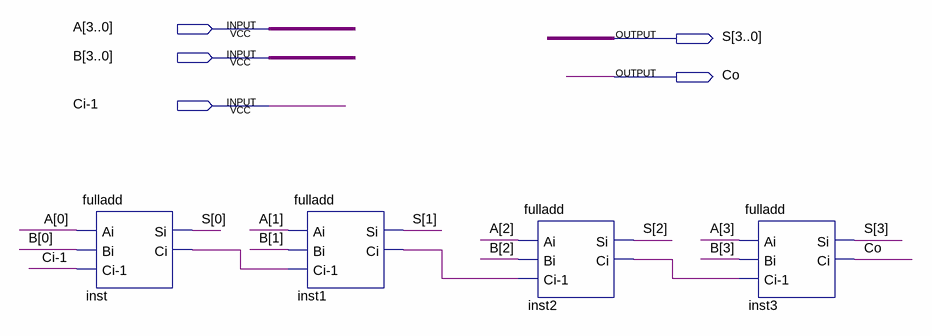
[diagram p0: schematic sheet]
// Quartus schematic adder4.bdf as structural Verilog: 4 symbols, 5 pins
module adder4 (
  input  [3:0] A,
  input  [3:0] B,
  input  \Ci-1 ,
  output [3:0] S,
  output Co
);

  wire inst1_ci, inst2_ci, inst_ci;

  fulladd inst (.Ai(A[0]), .Bi(B[0]), .\Ci-1 (\Ci-1 ), .Si(S[0]), .Ci(inst_ci));
  fulladd inst1 (.Ai(A[1]), .Bi(B[1]), .\Ci-1 (inst_ci), .Si(S[1]), .Ci(inst1_ci));
  fulladd inst2 (.Ai(A[2]), .Bi(B[2]), .\Ci-1 (inst1_ci), .Si(S[2]), .Ci(inst2_ci));
  fulladd inst3 (.Ai(A[3]), .Bi(B[3]), .\Ci-1 (inst2_ci), .Si(S[3]), .Ci(Co));
endmodule
